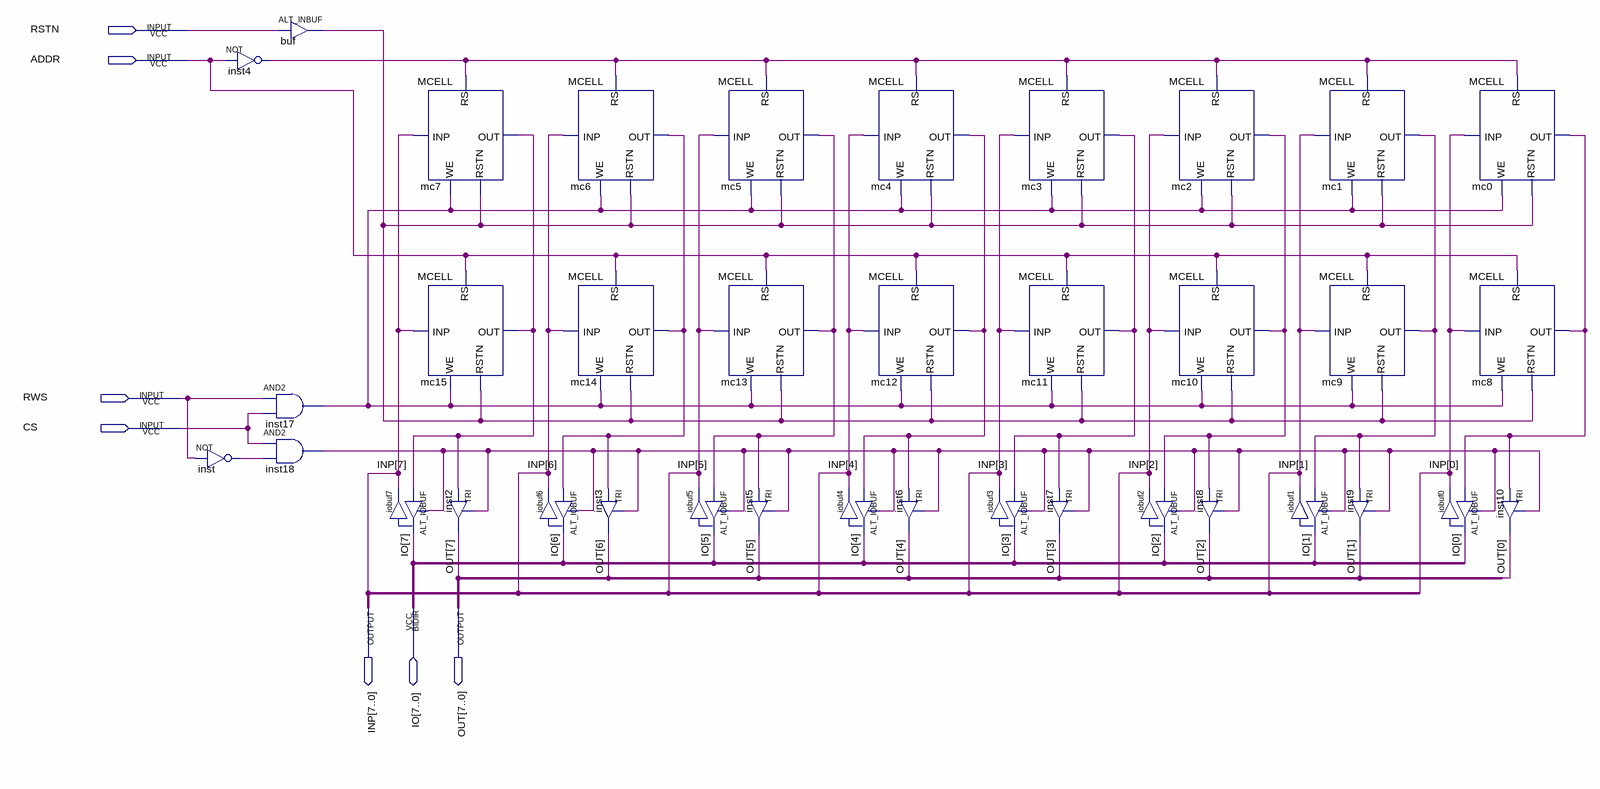
[diagram p0: schematic sheet]
// Quartus schematic testcell.bdf as structural Verilog: 37 symbols, 7 pins
module testcell (
  input  RSTN,
  input  ADDR,
  input  RWS,
  input  CS,
  inout  [7:0] IO,
  output [7:0] INP,
  output [7:0] OUT
);

  wire buf_o, inst4_out, inst17_out, inst18_out, inst_out, mc0_out, mc1_out, mc2_out, mc3_out, mc4_out,
       mc5_out, mc6_out, mc7_out;

  not inst4 (inst4_out, ADDR);
  not inst (inst_out, RWS);
  ALT_INBUF \buf  (.i(RSTN), .o(buf_o));
  and inst17 (inst17_out, RWS, CS);
  and inst18 (inst18_out, CS, inst_out);
  MCELL mc7 (.RS(inst4_out), .INP(INP[7]), .RSTN(buf_o), .WE(inst17_out), .OUT(mc7_out));
  MCELL mc15 (.RS(ADDR), .INP(INP[7]), .RSTN(buf_o), .WE(inst17_out), .OUT(mc7_out));
  ALT_IOBUF iobuf7 (.i(mc7_out), .oe(inst18_out), .o(INP[7]), .io(IO[7]));
  TRI inst2 (.IN(mc7_out), .OE(inst18_out), .OUT(OUT[7]));
  ALT_IOBUF iobuf6 (.i(mc6_out), .oe(inst18_out), .o(INP[6]), .io(IO[6]));
  MCELL mc6 (.RS(inst4_out), .INP(INP[6]), .RSTN(buf_o), .WE(inst17_out), .OUT(mc6_out));
  MCELL mc14 (.RS(ADDR), .INP(INP[6]), .RSTN(buf_o), .WE(inst17_out), .OUT(mc6_out));
  TRI inst3 (.IN(mc6_out), .OE(inst18_out), .OUT(OUT[6]));
  MCELL mc5 (.RS(inst4_out), .INP(INP[5]), .RSTN(buf_o), .WE(inst17_out), .OUT(mc5_out));
  MCELL mc13 (.RS(ADDR), .INP(INP[5]), .RSTN(buf_o), .WE(inst17_out), .OUT(mc5_out));
  ALT_IOBUF iobuf5 (.i(mc5_out), .oe(inst18_out), .o(INP[5]), .io(IO[5]));
  TRI inst5 (.IN(mc5_out), .OE(inst18_out), .OUT(OUT[5]));
  ALT_IOBUF iobuf4 (.i(mc4_out), .oe(inst18_out), .o(INP[4]), .io(IO[4]));
  MCELL mc4 (.RS(inst4_out), .INP(INP[4]), .RSTN(buf_o), .WE(inst17_out), .OUT(mc4_out));
  MCELL mc12 (.RS(ADDR), .INP(INP[4]), .RSTN(buf_o), .WE(inst17_out), .OUT(mc4_out));
  TRI inst6 (.IN(mc4_out), .OE(inst18_out), .OUT(OUT[4]));
  MCELL mc3 (.RS(inst4_out), .INP(INP[3]), .RSTN(buf_o), .WE(inst17_out), .OUT(mc3_out));
  MCELL mc11 (.RS(ADDR), .INP(INP[3]), .RSTN(buf_o), .WE(inst17_out), .OUT(mc3_out));
  ALT_IOBUF iobuf3 (.i(mc3_out), .oe(inst18_out), .o(INP[3]), .io(IO[3]));
  TRI inst7 (.IN(mc3_out), .OE(inst18_out), .OUT(OUT[3]));
  ALT_IOBUF iobuf2 (.i(mc2_out), .oe(inst18_out), .o(INP[2]), .io(IO[2]));
  MCELL mc2 (.RS(inst4_out), .INP(INP[2]), .RSTN(buf_o), .WE(inst17_out), .OUT(mc2_out));
  MCELL mc10 (.RS(ADDR), .INP(INP[2]), .RSTN(buf_o), .WE(inst17_out), .OUT(mc2_out));
  TRI inst8 (.IN(mc2_out), .OE(inst18_out), .OUT(OUT[2]));
  MCELL mc1 (.RS(inst4_out), .INP(INP[1]), .RSTN(buf_o), .WE(inst17_out), .OUT(mc1_out));
  MCELL mc9 (.RS(ADDR), .INP(INP[1]), .RSTN(buf_o), .WE(inst17_out), .OUT(mc1_out));
  ALT_IOBUF iobuf1 (.i(mc1_out), .oe(inst18_out), .o(INP[1]), .io(IO[1]));
  TRI inst9 (.IN(mc1_out), .OE(inst18_out), .OUT(OUT[1]));
  ALT_IOBUF iobuf0 (.i(mc0_out), .oe(inst18_out), .o(INP[0]), .io(IO[0]));
  MCELL mc0 (.RS(inst4_out), .INP(INP[0]), .RSTN(buf_o), .WE(inst17_out), .OUT(mc0_out));
  MCELL mc8 (.RS(ADDR), .INP(INP[0]), .RSTN(buf_o), .WE(inst17_out), .OUT(mc0_out));
  TRI inst10 (.IN(mc0_out), .OE(inst18_out), .OUT(OUT[0]));
endmodule
